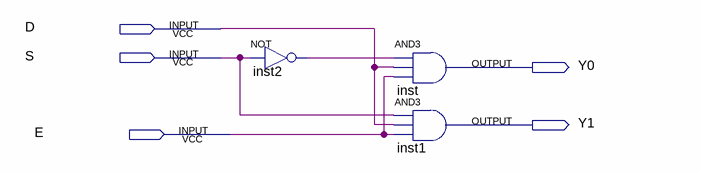
[diagram p0: schematic sheet]
// Quartus schematic DMUX12.bdf as structural Verilog: 3 symbols, 5 pins
module DMUX12 (
  input  D,
  input  S,
  input  E,
  output Y0,
  output Y1
);

  wire inst2_out;

  not inst2 (inst2_out, S);
  and inst (Y0, inst2_out, D, E);
  and inst1 (Y1, S, D, E);
endmodule
